# EAGLE design catbit (EAGLE 9.6.2)
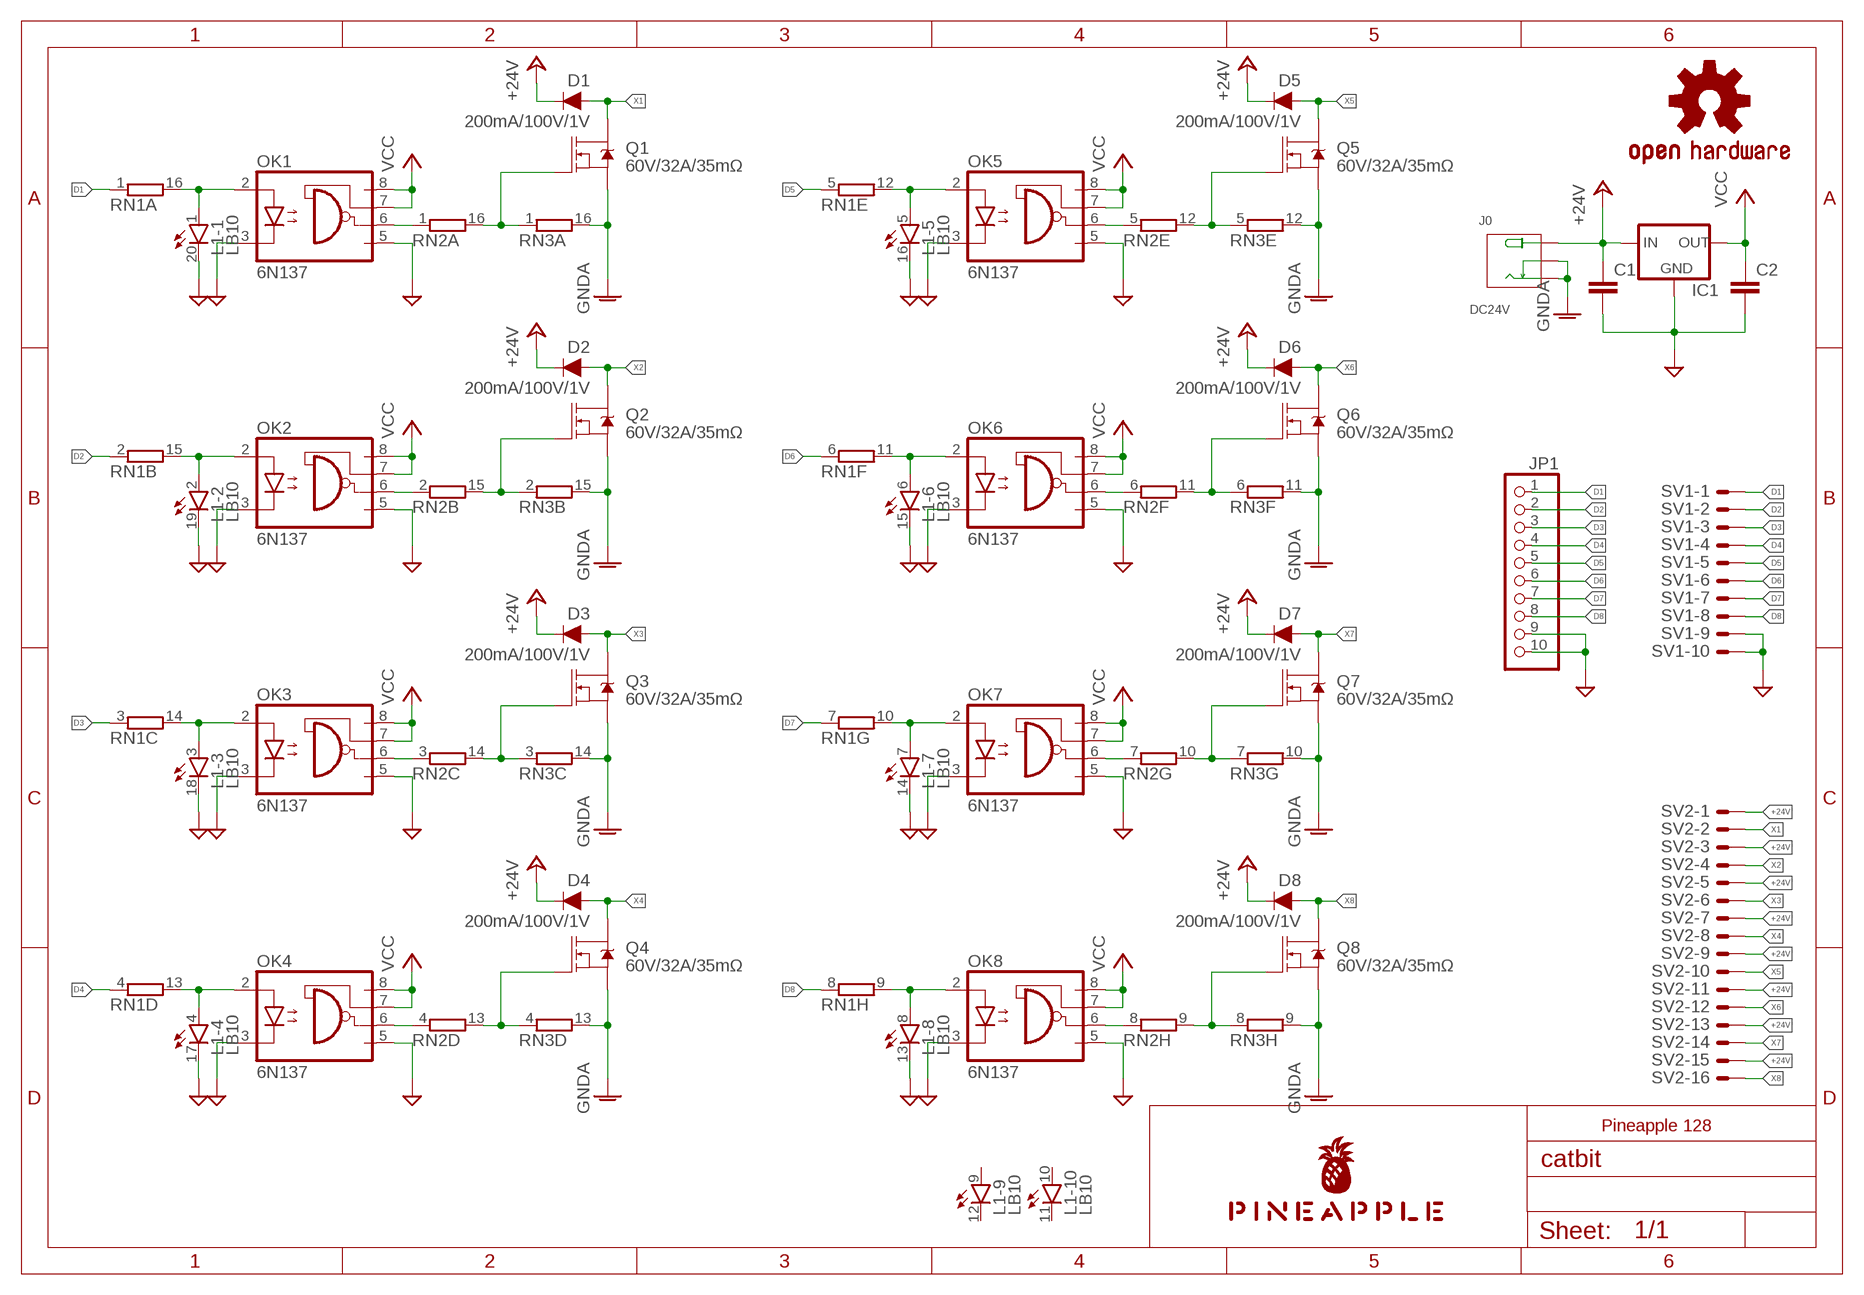
[diagram p0: schematic, sheet 1]

## Parts
C1  C-EU025-024X044  [C025-024X044]
C2  C-EU025-024X044  [C025-024X044]
D1  200mA/100V/1V  DIODE-1N4148  [DIODE-1N4148]
D2  200mA/100V/1V  DIODE-1N4148  [DIODE-1N4148]
D3  200mA/100V/1V  DIODE-1N4148  [DIODE-1N4148]
D4  200mA/100V/1V  DIODE-1N4148  [DIODE-1N4148]
D5  200mA/100V/1V  DIODE-1N4148  [DIODE-1N4148]
D6  200mA/100V/1V  DIODE-1N4148  [DIODE-1N4148]
D7  200mA/100V/1V  DIODE-1N4148  [DIODE-1N4148]
D8  200mA/100V/1V  DIODE-1N4148  [DIODE-1N4148]
IC1  78XXS  [78XXS]
J0  DC24V  JACK-DC-005'DC-005'  [3P-L14.2*W11.0*H9.0MM]
JP1  PINHD-1X10  [1X10]
L1  LB10  [LB10]
LOGO1  OSHW-LOGOS-COPPER  [OSHW-LOGO-S_COPPER]
OK1  6N137  [DIL08]
OK2  6N137  [DIL08]
OK3  6N137  [DIL08]
OK4  6N137  [DIL08]
OK5  6N137  [DIL08]
OK6  6N137  [DIL08]
OK7  6N137  [DIL08]
OK8  6N137  [DIL08]
Q1  60V/32A/35mΩ  MOSFET-NCH-FQP30N06L  [TO220V]
Q2  60V/32A/35mΩ  MOSFET-NCH-FQP30N06L  [TO220V]
Q3  60V/32A/35mΩ  MOSFET-NCH-FQP30N06L  [TO220V]
Q4  60V/32A/35mΩ  MOSFET-NCH-FQP30N06L  [TO220V]
Q5  60V/32A/35mΩ  MOSFET-NCH-FQP30N06L  [TO220V]
Q6  60V/32A/35mΩ  MOSFET-NCH-FQP30N06L  [TO220V]
Q7  60V/32A/35mΩ  MOSFET-NCH-FQP30N06L  [TO220V]
Q8  60V/32A/35mΩ  MOSFET-NCH-FQP30N06L  [TO220V]
RN1  8R-N  [DIL16]
RN2  8R-N  [DIL16]
RN3  8R-N  [DIL16]
SV1  ML10LE  [ML10L]
SV2  ML16LE  [ML16L]
U$1  PINEAPPLE450_SILK  [PINEAPPLE450_SILK]

## Nets
+24V [power]: C1.1 D1.C D2.C D3.C D4.C D5.C D6.C D7.C D8.C IC1.IN J0.+ SV2.1 SV2.3 SV2.5 SV2.7 SV2.9 SV2.11 SV2.13 SV2.15
D1: JP1.1 RN1.1 SV1.1
D2: JP1.2 RN1.2 SV1.2
D3: JP1.3 RN1.3 SV1.3
D4: JP1.4 RN1.4 SV1.4
D5: JP1.5 RN1.5 SV1.5
D6: JP1.6 RN1.6 SV1.6
D7: JP1.7 RN1.7 SV1.7
D8: JP1.8 RN1.8 SV1.8
GND [gnd]: C1.2 C2.2 IC1.GND JP1.9 JP1.10 L1.13(-8:C) L1.14(-7:C) L1.15(-6:C) L1.16(-5:C) L1.17(-4:C) L1.18(-3:C) L1.19(-2:C) L1.20(-1:C) OK1.3(C) OK1.5(GND) OK2.3(C) OK2.5(GND) OK3.3(C) OK3.5(GND) OK4.3(C) OK4.5(GND) OK5.3(C) OK5.5(GND) OK6.3(C) OK6.5(GND) OK7.3(C) OK7.5(GND) OK8.3(C) OK8.5(GND) SV1.9 SV1.10
GNDA [gnd]: J0.-1(-) J0.-2(CDN) Q1.3(S) Q2.3(S) Q3.3(S) Q4.3(S) Q5.3(S) Q6.3(S) Q7.3(S) Q8.3(S) RN3.9 RN3.10 RN3.11 RN3.12 RN3.13 RN3.14 RN3.15 RN3.16
N$1: L1.1(-1:A) OK1.2(A) RN1.16
N$2: OK1.6(VO) RN2.1
N$3: Q1.1(G) RN2.16 RN3.1
N$4: L1.2(-2:A) OK2.2(A) RN1.15
N$5: OK2.6(VO) RN2.2
N$6: Q2.1(G) RN2.15 RN3.2
N$7: L1.3(-3:A) OK3.2(A) RN1.14
N$8: OK3.6(VO) RN2.3
N$9: Q3.1(G) RN2.14 RN3.3
N$10: L1.4(-4:A) OK4.2(A) RN1.13
N$11: OK4.6(VO) RN2.4
N$12: Q4.1(G) RN2.13 RN3.4
N$13: L1.5(-5:A) OK5.2(A) RN1.12
N$14: OK5.6(VO) RN2.5
N$15: Q5.1(G) RN2.12 RN3.5
N$16: L1.6(-6:A) OK6.2(A) RN1.11
N$17: OK6.6(VO) RN2.6
N$18: Q6.1(G) RN2.11 RN3.6
N$19: L1.7(-7:A) OK7.2(A) RN1.10
N$20: OK7.6(VO) RN2.7
N$21: Q7.1(G) RN2.10 RN3.7
N$22: L1.8(-8:A) OK8.2(A) RN1.9
N$23: OK8.6(VO) RN2.8
N$24: Q8.1(G) RN2.9 RN3.8
VCC [power]: C2.1 IC1.OUT OK1.7(VE) OK1.8(VCC) OK2.7(VE) OK2.8(VCC) OK3.7(VE) OK3.8(VCC) OK4.7(VE) OK4.8(VCC) OK5.7(VE) OK5.8(VCC) OK6.7(VE) OK6.8(VCC) OK7.7(VE) OK7.8(VCC) OK8.7(VE) OK8.8(VCC)
X1: D1.A Q1.2(D) SV2.2
X2: D2.A Q2.2(D) SV2.4
X3: D3.A Q3.2(D) SV2.6
X4: D4.A Q4.2(D) SV2.8
X5: D5.A Q5.2(D) SV2.10
X6: D6.A Q6.2(D) SV2.12
X7: D7.A Q7.2(D) SV2.14
X8: D8.A Q8.2(D) SV2.16
Unconnected: L1.9(-9:A) L1.10(-10:A) L1.11(-10:C) L1.12(-9:C)

## Notes on the sheet
- Pineapple 128

## Library data of the parts
C1 C2 = resistor:C-EU: CAPACITOR, European symbol
D1-D8 = SparkFun-DiscreteSemi:DIODE: Diode These are standard reverse protection diodes and small signal diodes. SparkFun Products: SparkFun SparkPunk Sound Kit <https://www.sparkfun.com/products/11177> SparkFun ESP8266 Thing <https://www.sparkfun.com/products/13231>; PROD_ID: DIO-08378
IC1 = v-reg:78XXS: VOLTAGE REGULATOR
J0 = Seeed-Connector:JACK-DC-005: 320120003
JP1 = pinhead:PINHD-1X10: PIN HEADER
L1 = led:LB10: LED BLOCK 10-LED bar graph, DIL, Siemens
LOGO1 = SparkFun-Aesthetics:OSHW-LOGO: Open-Source Hardware (OSHW) Logo This logo indicates the piece of hardware it is found on incorporates a OSHW license and/or adheres to the definition of open source hardware found here: http://freedomdefined.org/OSHW
OK1-OK8 = optocoupler:6N137: MOTOROLA OPTO COUPLER; MPN: 6N137; OC_FARNELL: 1328376; OC_NEWARK: 52M1895
Q1-Q8 = SparkFun-DiscreteSemi:MOSFET-NCH: N-channel MOSFETs Voltage controlled devices that allow control of high current outputs. SparkFun Products: SparkFun OpenScale <https://www.sparkfun.com/products/13261> SparkFun Digital Sandbox <https://www.sparkfun.com/products/12651> SparkFun Monster Moto Shield <https://www.sparkfun.com/products/10182> SparkFun MOSFET Power Controller <https://www.sparkfun.com/products/11214>; PROD_ID: TRANS-10060
RN1-RN3 = resistor-dil:8R-N: DIL RESISTOR; OC_FARNELL: unknown; OC_NEWARK: unknown
SV1 = con-ml:ML10LE: HARTING; OC_FARNELL: unknown; OC_NEWARK: unknown
SV2 = con-ml:ML16LE: HARTING; OC_FARNELL: unknown; OC_NEWARK: unknown
U$1 = pineapple:PINEAPPLE450_SILK

## Net classes
0 default: width 0.152 mm, drill 0.152 mm, clearance 0.152 mm
1 gnd: width 0.305 mm, drill 0.152 mm, clearance 0.152 mm
2 power: width 0.305 mm, drill 0.152 mm, clearance 0.152 mm
3 analog: width 0.152 mm, drill 0.152 mm, clearance 0.152 mm

## Board
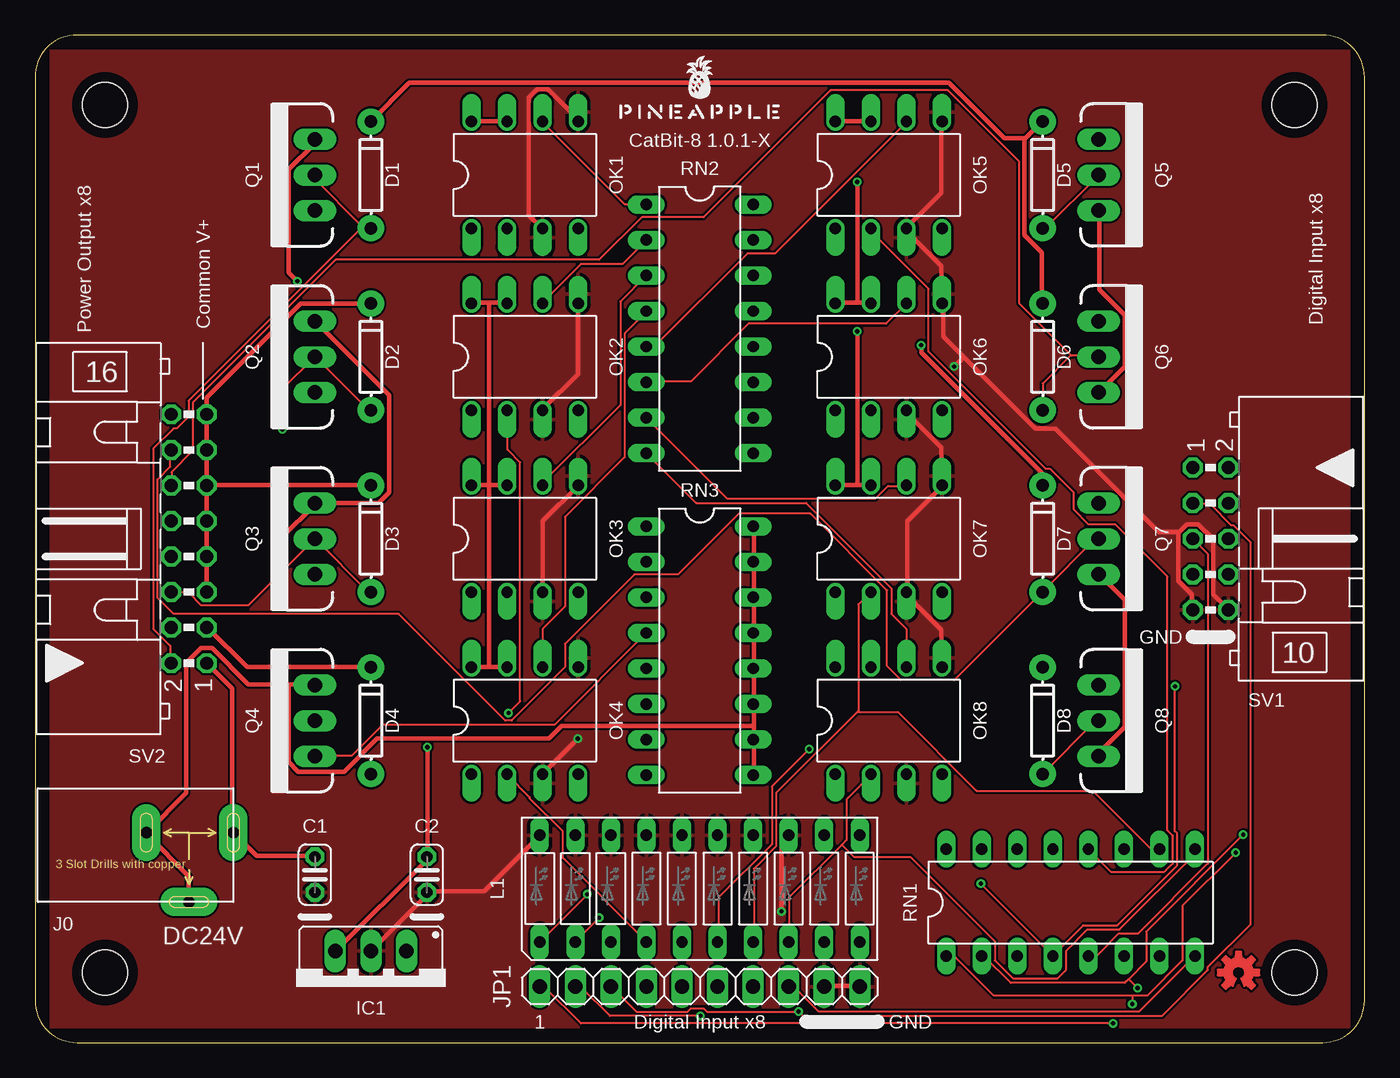
[diagram p1: board, top side]
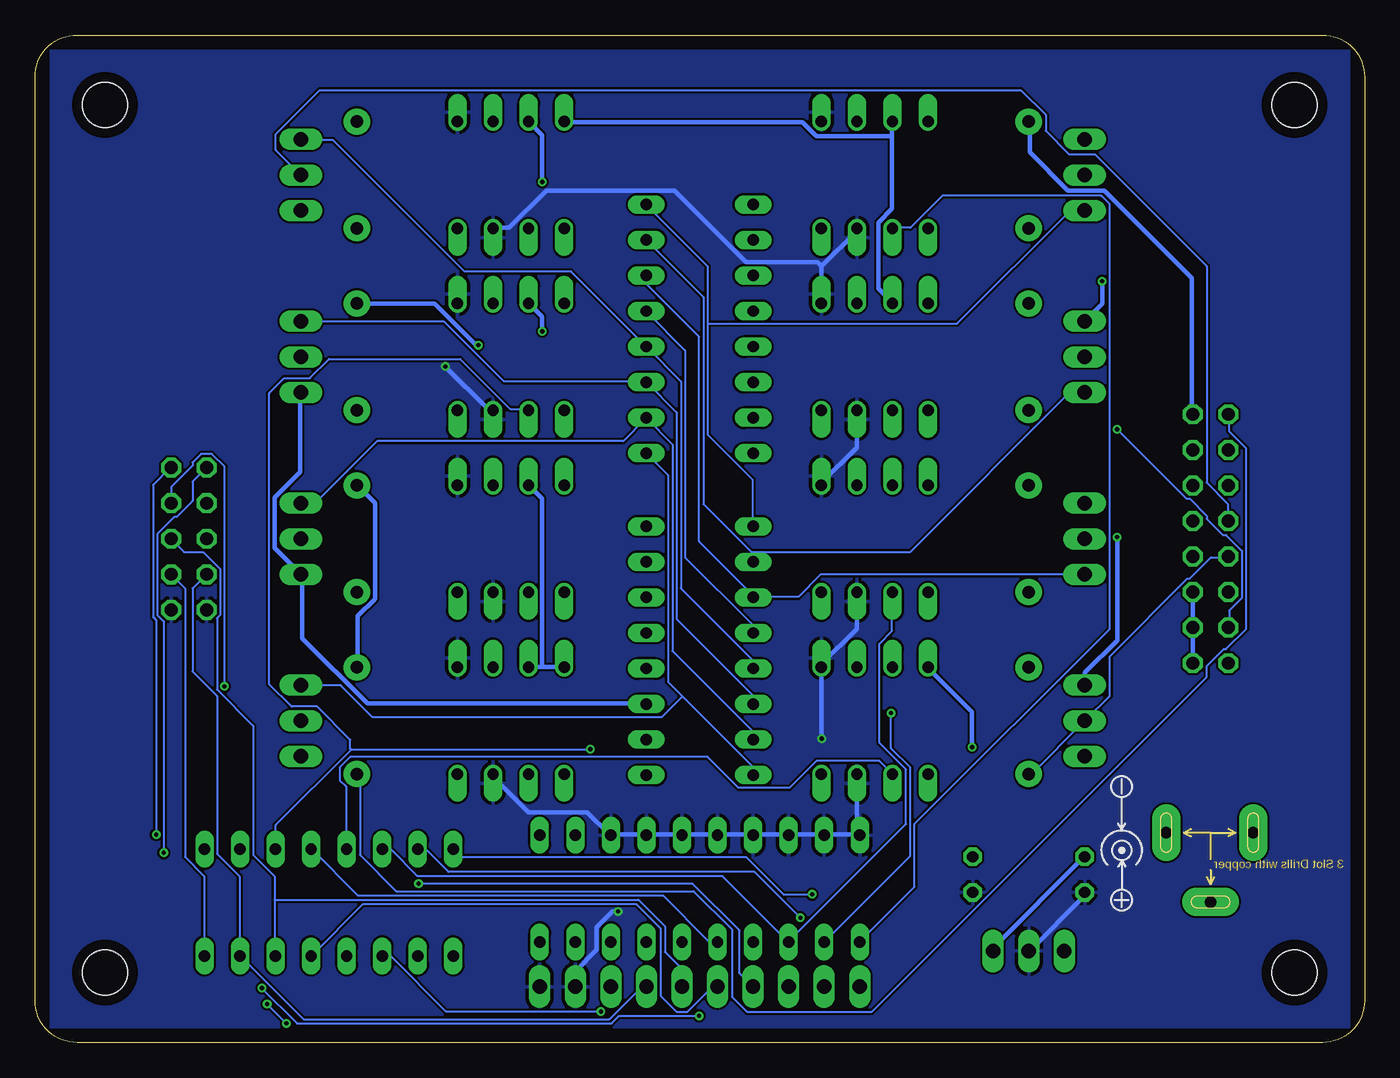
[diagram p2: board, bottom side, seen from below]

Size 95 x 72 mm. Coordinates in mm from the lower left corner, seen from the top.
Outline: 3,0 92,0 arc90 95,3 95,69 arc90 92,72 3,72 arc90 0,69 0,3 arc90 3,0
Copper layers (1*16): Top 0.035mm / dielectric 1.5mm / Bottom 0.035mm
Design rules "SeeedStudio_2layer_DRU_no_angle_20140221": minimum track width 6mil, minimum drill 12mil, track to track 6mil, track to pad 6mil, pad to pad 6mil, via to via 6mil, smd to smd 0mil, copper to edge 10mil, drill to drill 10mil, minimum pad ring 10mil, minimum via ring 6mil, stop-mask expansion 2mil, vias tented up to drill 100mil, thermal gap 10mil
Holes 3.2 mm at 5,5 90,5 90,67 5,67
tRestrict: area 2.8,64.8 to 7.2,69.2; area 87.8,64.8 to 92.2,69.2; area 2.8,2.8 to 7.2,7.2; area 87.8,2.8 to 92.2,7.2; area 0,71 to 95,72; area 94,0 to 95,72; area 0,0 to 95,1; area 0,0 to 1,72
bRestrict: area 2.8,2.8 to 7.2,7.2; area 87.8,2.8 to 92.2,7.2; area 87.8,64.8 to 92.2,69.2; area 2.8,64.8 to 7.2,69.2; area 0,71 to 95,72; area 94,0 to 95,72; area 0,0 to 95,1; area 0,0 to 1,72

### Footprints (pad centres in the part's own frame; a part is rotated, then mirrored left to right if it is on the bottom)
C025-024X044 = drill 0.813 octagon: 1 -1.27,0; 2 1.27,0
DIODE-1N4148 = drill 0.9 pad 1.88: A -3.81,0; C 3.81,0
78XXS = drill 1.016 long: GND 0,-2.54; IN -2.54,-2.54; OUT 2.54,-2.54
3P-L14.2*W11.0*H9.0MM = drill 0.813 pad 2.032 long: + 3.175,0; -1 -3.048,0; -2 0,-4.953
1X10 = drill 1.016 long: 1 -11.43,0; 2 -8.89,0; 3 -6.35,0; 4 -3.81,0; 5 -1.27,0; 6 1.27,0; 7 3.81,0; 8 6.35,0; 9 8.89,0; 10 11.43,0
LB10 = drill 0.813 long: 1 -11.43,-3.81; 2 -8.89,-3.81; 3 -6.35,-3.81; 4 -3.81,-3.81; 5 -1.27,-3.81; 6 1.27,-3.81; 7 3.81,-3.81; 8 6.35,-3.81; 9 8.89,-3.81; 10 11.43,-3.81; 11 11.43,3.81; 12 8.89,3.81; 13 6.35,3.81; 14 3.81,3.81; 15 1.27,3.81; 16 -1.27,3.81; 17 -3.81,3.81; 18 -6.35,3.81; 19 -8.89,3.81; 20 -11.43,3.81
DIL08 = drill 0.813 offset: 1 -3.81,-3.81; 2 -1.27,-3.81; 3 1.27,-3.81; 4 3.81,-3.81; 5 3.81,3.81; 6 1.27,3.81; 7 -1.27,3.81; 8 -3.81,3.81
TO220V = drill 1.016 long: 1 -2.54,0; 2 0,0; 3 2.54,0
DIL16 = drill 0.813 long: 1 -8.89,-3.81; 2 -6.35,-3.81; 3 -3.81,-3.81; 4 -1.27,-3.81; 5 1.27,-3.81; 6 3.81,-3.81; 7 6.35,-3.81; 8 8.89,-3.81; 9 8.89,3.81; 10 6.35,3.81; 11 3.81,3.81; 12 1.27,3.81; 13 -1.27,3.81; 14 -3.81,3.81; 15 -6.35,3.81; 16 -8.89,3.81
ML10L = drill 0.914 octagon: 1 -5.08,-1.27; 2 -5.08,1.27; 3 -2.54,-1.27; 4 -2.54,1.27; 5 0,-1.27; 6 0,1.27; 7 2.54,-1.27; 8 2.54,1.27; 9 5.08,-1.27; 10 5.08,1.27
ML16L = drill 0.914 octagon: 1 -8.89,-1.27; 2 -8.89,1.27; 3 -6.35,-1.27; 4 -6.35,1.27; 5 -3.81,-1.27; 6 -3.81,1.27; 7 -1.27,-1.27; 8 -1.27,1.27; 9 1.27,-1.27; 10 1.27,1.27; 11 3.81,-1.27; 12 3.81,1.27; 13 6.35,-1.27; 14 6.35,1.27; 15 8.89,-1.27; 16 8.89,1.27

### Placement (x,y rotation side)
C1  20,12 270 top
C2  28,12 270 top
D1  24,62 90 top
D2  24,49 90 top
D3  24,36 90 top
D4  24,23 90 top
D5  72,62 90 top
D6  72,49 90 top
D7  72,36 90 top
D8  72,23 90 top
IC1  24,4 180 top
J0  11,15 0 top
JP1  47.5,4 0 top
L1  47.5,11 0 top
LOGO1  86,5 0 top
OK1  35,62 0 top
OK2  35,49 0 top
OK3  35,36 0 top
OK4  35,23 0 top
OK5  61,62 0 top
OK6  61,49 0 top
OK7  61,36 0 top
OK8  61,23 0 top
Q1  20,62 90 top
Q2  20,49 90 top
Q3  20,36 90 top
Q4  20,23 90 top
Q5  76,62 270 top
Q6  76,49 270 top
Q7  76,36 270 top
Q8  76,23 270 top
RN1  74,10 0 top
RN2  47.5,51 270 top
RN3  47.5,28 270 top
SV1  84,36 270 top
SV2  11,36 90 top
U$1  47.5,66 0 top

### Tracks (layer width: path | path; a pad name or v marks a point on that pad's centre or on a via)
+24V  (via drill 0.3)
  Top 0.305: 70.71,64.54 70.71,57.68 71.93,56.46 71.93,52.88 D6.C | 70.71,64.54 71.93,65.76 D5.C | v63.32,49.84 63.32,49.3 71.93,40.69 71.93,39.85 D7.C | C1.1 19.96,13.34 15.85,13.34 14.25,14.94 J0.+ 14.1,15.09 14.1,25.3 12.34,27.05 SV2.1 | SV2.5 12.27,32.23 12.27,34.67 SV2.7 12.27,34.82 SV2.9 12.27,37.41 12.27,39.78 SV2.11 | SV2.11 12.27,39.93 12.27,42.29 SV2.13 12.27,42.44 SV2.15 12.27,45.03 12.27,46.1 18.97,52.81 23.93,52.81 D2.C | D4.C 23.93,26.82 15.16,26.82 12.34,29.64 SV2.3 | D3.C 23.93,39.85 12.42,39.85 SV2.11 | 70.71,64.54 70.64,64.62 69.27,64.62 65.3,68.58 26.75,68.58 24,65.84 D1.C
  Bottom 0.305: D8.C 71.93,26.82 71.93,30.48 70.71,31.7 70.71,38.56 71.93,39.78 D7.C | v63.32,49.84 63.48,49.84 66.45,52.81 71.93,52.81 D6.C | IC1.IN 26.52,6.55 26.52,6.78 20.04,13.26 C1.1 | SV2.1 12.27,27.13 SV2.3 12.27,29.79 12.27,32.16 SV2.5 | D1.C 23.93,65.76 23.93,63.63 21.18,60.88 18.59,60.88 12.34,54.63 12.34,44.96 SV2.15
D1  (via drill 0.3)
  Top 0.152: 78.41,3.35 79.48,3.35 81.99,5.87 81.99,9.75 v85.8,13.56 | 78.41,3.35 68.5,3.35 65.68,6.17 65.15,6.17 RN1.1 | v77.04,1.37 39.01,1.37 36.42,3.96 36.12,3.96 JP1.1 | 78.41,3.35 v78.41,2.74
  Bottom 0.152: v85.8,13.56 85.8,30.1 86.26,30.56 86.26,36.35 85.04,37.57 84.89,37.57 83.74,38.71 83.74,40.08 82.75,41.07 SV1.1 | v78.41,2.74 v77.04,1.37
D2  (via drill 0.3)
  Top 0.152: 78.14,4.53 79.4,5.79 79.4,7.92 v86.33,14.86 | 78.14,4.53 77.88,4.27 69.72,4.27 67.82,6.17 67.67,6.17 RN1.2 | v47.55,1.91 41.07,1.91 39.01,3.96 38.63,3.96 JP1.2 | 78.14,4.53 v78.79,3.89
  Bottom 0.152: v86.33,14.86 86.33,30.18 86.56,30.4 86.56,39.85 85.34,41.07 SV1.2 | v47.55,1.91 53.26,1.91 53.8,1.37 76.28,1.37 v78.79,3.89
D3  (via drill 0.3)
  Top 0.152: JP1.3 41.22,3.96 42.98,2.21 46.63,2.21 46.86,2.44 47.78,2.44 48.01,2.21 v54.56,2.21 54.86,1.91 80.54,1.91 83.82,5.18 83.82,5.41 86.87,8.46 86.87,35.74 85.65,36.96 85.5,36.96 83.97,38.48 82.75,38.48 SV1.3
  Bottom 0.152: v54.56,2.21 65.61,2.21 69.57,6.17 70.18,6.17 RN1.3
D4  (via drill 0.3)
  Top 0.152: v67.59,11.35 72.69,6.25 RN1.4 72.77,6.25 74.91,8.38 77.34,8.38 81.61,12.65 81.61,14.94 81.46,15.09 v81.46,25.45
  Bottom 0.152: v67.59,11.35 48.01,11.35 44.65,8 44.65,4.95 43.74,4.04 JP1.4 | v81.46,25.45 81.46,41.15 82.37,42.06 83.13,42.06 83.74,41.45 83.74,41.22 85.27,39.7 85.27,38.56 SV1.4
D5
  Top 0.152: RN1.5 75.29,6.25 75.89,6.25 77.42,7.77 78.79,7.77 83.82,12.8 83.82,34.9 82.75,35.97 SV1.5
  Bottom 0.152: JP1.5 46.25,3.96 46.63,3.96 48.39,2.21 49.15,2.21 50.29,3.35 50.29,8.15 52.05,9.91 71.55,9.91 75.21,6.25 RN1.5
D6
  Bottom 0.152: 77.88,10.21 77.88,11.89 79.4,13.41 79.4,22.63 81.99,25.22 81.99,30.33 81.76,30.56 81.76,33.83 82.98,35.05 84.35,35.05 85.27,35.97 SV1.6 | 77.88,10.21 77.88,6.25 RN1.6 | 77.88,10.21 51.89,10.21 49.99,8.31 49.99,6.48 48.84,5.33 48.84,4.04 JP1.6
D7
  Bottom 0.152: SV1.7 82.75,33.45 83.74,32.46 83.74,26.52 81.99,24.77 81.99,13.49 80.39,11.89 80.39,6.25 RN1.7 80.31,6.17 75.82,1.68 53.95,1.68 51.66,3.96 51.36,3.96 JP1.7
D8
  Top 0.152: JP1.8 53.87,3.96 54.25,3.96 56.01,2.21 78.87,2.21 82.83,6.17 RN1.8
  Bottom 0.152: RN1.8 82.91,6.25 82.91,11.89 84.28,13.26 84.28,32.46 SV1.8
GND  (via drill 0.3)
  Top 0.305: OK8.5 64.77,26.82 64.77,29.49 62.33,31.93 62.33,32.16 OK7.3 62.33,32.31 62.33,37.26 64.77,39.7 OK7.5 64.77,39.85 64.77,42.52 62.33,44.96 62.33,45.19 OK6.3 | 81.69,36.42 81.69,32.99 82.68,32 82.68,30.94 SV1.9 | 81.69,36.42 82.3,37.03 83.13,37.03 84.2,35.97 84.2,32 85.27,30.94 SV1.10 | OK5.5 64.77,65.76 64.77,60.73 62.33,58.29 OK5.3 62.33,58.14 62.33,57.91 64.77,55.47 64.77,52.88 OK6.5 64.92,52.73 64.92,50.44 66.37,49 | 66.37,49 71.48,43.89 72.92,43.89 80.31,36.5 81.61,36.5 81.69,36.42 | 66.37,49 v65.68,48.31 | OK1.5 38.79,65.84 38.79,65.99 36.65,68.12 35.89,68.12 35.28,67.51 35.28,59.13 36.2,58.22 OK1.3 | OK3.3 36.27,32.23 36.27,37.26 38.79,39.78 OK3.5 | OK2.5 38.79,52.81 38.79,47.78 36.27,45.26 OK2.3 | IC1.GND 24,6.55 27.96,10.52 27.96,10.67 C2.2 28.12,10.82 32.08,10.82 36.04,14.78 L1.20 | JP1.9 56.46,4.04 58.9,4.04 JP1.10 | v53.34,9.37 53.34,14.33 53.8,14.78 L1.13 | v38.79,21.72 36.27,19.2 OK4.3
  Bottom 0.305: v65.68,48.31 62.64,45.26 62.33,45.26 OK6.3 | 38.79,55.47 38.79,52.88 OK2.5 | 38.79,55.47 36.27,57.99 36.27,58.14 OK1.3 | OK3.3 36.27,32.16 36.27,29.57 38.79,27.05 38.79,26.82 OK4.5 38.79,26.67 v38.79,21.72 | OK2.3 36.27,42.52 38.79,40.01 38.79,39.85 OK3.5 | C1.2 20.04,10.67 20.04,10.44 23.93,6.55 IC1.GND | OK4.3 36.27,19.13 36.27,14.94 L1.20 36.12,14.86 38.56,14.86 L1.19 38.71,14.86 41.15,14.86 L1.18 41.3,14.86 43.66,14.86 L1.17 43.81,14.86 46.18,14.86 L1.16 46.33,14.86 48.77,14.86 L1.15 48.92,14.86 51.28,14.86 L1.14 51.44,14.86 53.8,14.86 L1.13 53.95,14.86 55.55,16.46 59.74,16.46 62.26,18.97 62.26,19.13 OK8.3 | v53.34,9.37 53.72,9.37 54.86,8.23 54.86,6.63 56.39,5.11 56.39,4.04 JP1.9 | 38.79,55.47 39.09,55.78 44.2,55.78 49.3,60.88 58.45,60.88 61.11,58.22 62.26,58.22 OK5.3
  pour Top: -1,-1 96,-1 96,73 -1,73
  pour Bottom: -2,-2 97,-2 97,74 -2,74
GNDA  (via drill 0.3)
  Top 0.305: RN3.9 51.36,19.13 51.36,21.64 RN3.10 51.36,21.79 51.36,22.63 | 51.36,22.63 51.36,24.16 RN3.11 51.36,24.31 51.36,26.67 RN3.12 51.36,26.82 51.36,29.26 RN3.13 51.36,29.41 51.36,31.77 RN3.14 51.36,31.93 51.36,34.29 RN3.15 51.36,34.44 51.36,36.88 RN3.16 | Q8.3 76.05,20.5 76.05,20.73 77.88,22.55 77.88,31.62 76.05,33.45 Q7.3 | Q5.3 76.05,59.44 76.05,53.8 77.88,51.97 77.88,48.31 76.05,46.48 Q6.3 | Q2.3 20.04,51.51 25.3,46.25 25.3,39.32 24.54,38.56 20.04,38.56 Q3.3 19.96,38.41 v17.68,36.12 | v18.75,54.41 18.14,55.02 18.14,62.41 19.96,64.24 19.96,64.47 Q1.3 | 18.14,25.6 15.24,25.6 12.65,28.19 11.89,28.19 10.82,27.13 10.82,17.83 8,15.01 J0.-1 8,14.86 10.97,11.89 10.97,10.06 J0.-2 | 18.14,25.6 19.96,25.6 Q4.3 | 51.36,22.63 37.64,22.63 36.73,21.72 24.46,21.72 22.1,19.36 18.82,19.36 18.14,20.04 18.14,25.6
  Bottom 0.305: Q6.3 76.05,46.41 76.05,40.77 77.88,38.94 77.88,35.36 76.05,33.53 Q7.3 75.89,33.38 75.89,28.88 71.25,24.23 51.36,24.23 RN3.11 | v18.75,54.41 18.75,52.81 19.96,51.59 Q2.3 | v17.68,36.12 17.68,28.73 19.96,26.44 19.96,25.6 Q4.3
N$1  (via drill 0.3)
  Top 0.152: v39.47,10.59 36.12,7.24 L1.1
  Bottom 0.152: v39.47,10.59 41.53,10.59 44.2,13.26 64.54,13.26 65.08,13.79 RN1.16 | OK1.2 33.68,58.22 32.46,58.22 30.18,60.5 18.82,60.5 18.21,59.89 18.21,29.57 32.16,15.62 32.16,11.12 36.04,7.24 L1.1
N$2
  Top 0.152: RN2.1 43.66,59.89 42.14,59.89 36.27,65.76 OK1.6
N$3
  Bottom 0.152: 46.94,51.36 46.94,55.47 51.28,59.82 RN2.16 | 46.94,51.36 46.94,43.43 43.74,40.23 43.74,36.96 RN3.1 | 46.94,51.36 29.11,51.36 21.03,59.44 20.04,59.44 Q1.1
N$4  (via drill 0.3)
  Top 0.152: v33.83,23.55 34.67,24.38 34.67,41.45 33.76,42.37 33.76,45.19 OK2.2 | v40.31,8.91 38.63,7.24 L1.2
  Bottom 0.152: v33.83,23.55 33.83,21.03 32.46,19.66 32.46,13.34 38.56,7.24 L1.2 | v40.31,8.91 43.59,12.19 65.46,12.19 67.06,13.79 67.59,13.79 RN1.15
N$5
  Top 0.152: OK2.6 36.27,52.88 39.01,55.63 41.99,55.63 43.66,57.3 RN2.2
N$6
  Bottom 0.152: 43.78,35.01 47.24,38.48 47.24,53.26 51.28,57.3 RN2.15 | 43.78,35.01 43.74,34.98 43.74,34.37 RN3.2 | Q2.1 20.04,46.41 21.11,46.41 32.46,35.05 43.74,35.05 43.78,35.01
N$7
  Bottom 0.152: OK3.2 33.76,32.16 33.76,29.41 34.67,28.5 34.67,21.41 32.77,19.51 32.77,15.62 41.15,7.24 L1.3 41.22,7.24 45.87,11.89 67.67,11.89 69.57,13.79 70.18,13.79 RN1.14
N$8
  Top 0.152: OK3.6 36.27,39.85 36.27,40.01 41.83,45.57 41.83,52.96 43.66,54.79 RN2.3
N$9
  Bottom 0.152: Q3.1 20.04,33.45 38.86,33.45 40.46,31.85 43.66,31.85 RN3.3 43.66,31.93 47.55,35.81 47.55,50.44 51.28,54.18 51.28,54.79 RN2.14
N$10
  Top 0.152: OK4.2 33.76,19.13 35.36,17.53 35.36,17.45 37.72,15.09 37.72,13.18 43.66,7.24 L1.4
  Bottom 0.152: RN1.13 72.77,13.87 72.77,18.29 73.23,18.75 73.23,19.66 72.47,20.42 46.94,20.42 44.73,18.21 41.07,18.21 39.17,20.12 34.67,20.12 33.76,19.2 OK4.2
N$11
  Top 0.152: OK4.6 36.27,26.82 36.27,29.57 37.87,31.17 37.87,37.57 42.14,41.83 42.14,50.67 43.66,52.2 RN2.4
N$12
  Top 0.152: Q4.1 20.04,20.5 22.63,20.5 24.84,22.71 37.11,22.71 43.66,29.26 RN3.4
  Bottom 0.152: RN3.4 43.74,29.34 43.74,29.87 48.54,34.67 48.54,49.45 51.28,52.2 RN2.13
N$13
  Top 0.152: OK5.2 59.74,58.14 59.74,57.99 63.86,53.87 63.86,49.38 72.24,41 72.54,41 74.22,39.32 74.22,38.1 75.29,37.03 77.19,37.03 80.92,33.3 80.92,15.16 81.31,14.78 81.31,12.8 80.7,12.19 76.89,12.19 75.29,13.79 RN1.12
  Bottom 0.152: L1.5 46.25,7.24 46.86,7.24 50.14,10.52 71.93,10.52 75.21,13.79 RN1.12
N$14
  Top 0.152: RN2.5 43.74,49.76 44.27,49.76 50.9,56.39 52.88,56.39 62.26,65.76 OK5.6
N$15
  Bottom 0.152: RN3.5 43.74,26.75 43.74,27.36 48.84,32.46 48.84,47.24 51.28,49.68 RN2.12 51.36,49.76 56.69,55.09 64.31,55.09 73.69,64.47 75.97,64.47 Q5.1
N$16  (via drill 0.3)
  Top 0.152: v55.32,20.95 52.65,18.29 52.65,14.17 48.84,10.36 48.84,7.24 L1.6
  Bottom 0.152: v55.32,20.95 72.39,20.95 72.43,20.92 | 72.43,20.92 77.8,15.54 77.8,13.87 RN1.11 | OK6.2 59.74,45.26 61.04,45.26 64.62,48.84 73.99,48.84 75.36,47.47 77.19,47.47 78.26,46.41 78.26,25.6 76.66,24 74.83,24 72.47,21.64 72.47,20.95 72.43,20.92
N$17
  Top 0.152: RN2.6 43.74,47.24 46.86,47.24 50.98,51.36 60.81,51.36 62.26,52.81 OK6.6
N$18
  Bottom 0.152: RN3.6 43.74,24.23 43.74,24.84 49.15,30.25 49.15,45.03 51.28,47.17 RN2.11 51.36,47.24 61.49,47.24 65.76,51.51 75.97,51.51 Q6.1
N$19
  Top 0.152: 58.79,23.66 58.83,23.7 58.83,31.32 59.66,32.16 OK7.2 | 58.79,23.66 52.96,17.83 52.96,14.02 51.36,12.42 51.36,7.24 L1.7 | RN1.10 80.31,13.87 79.7,13.87 75.59,17.98 67.28,17.98 61.65,23.62 58.83,23.62 58.79,23.66
N$20
  Top 0.152: OK7.6 62.26,39.78 60.96,39.78 60.05,38.86 49.45,38.86 43.74,44.58 RN2.7
N$21
  Bottom 0.152: RN3.7 43.74,21.72 43.74,22.25 49.45,27.96 49.45,42.75 51.28,44.58 RN2.10 51.36,44.58 52.96,42.98 70.56,42.98 74.98,38.56 75.97,38.56 Q7.1
N$22
  Top 0.152: 57.65,14.13 57.99,14.48 57.99,17.37 59.74,19.13 OK8.2 | 57.65,14.13 53.87,10.36 53.87,7.24 L1.8 | 57.65,14.13 58.52,13.26 62.56,13.26 68.58,7.24 68.58,5.87 69.88,4.57 73.08,4.57 73.69,5.18 73.69,6.55 75.21,8.08 77.5,8.08 82.83,13.41 82.83,13.79 RN1.9
N$23
  Top 0.152: OK8.6 62.26,26.82 62.26,29.57 61.19,30.63 61.19,32.46 55.09,38.56 47.24,38.56 43.74,42.06 RN2.8
N$24
  Bottom 0.152: 48.73,24.73 49.76,25.76 49.76,40.54 51.28,42.06 RN2.9 | 48.73,24.73 43.74,19.74 43.74,19.13 RN3.8 | 48.73,24.73 50.22,23.24 70.87,23.24 73.15,25.53 75.97,25.53 Q8.1
VCC  (via drill 0.3)
  Top 0.305: 58.75,39.85 59.66,39.85 OK7.7 | 58.75,39.85 57.23,39.85 OK7.8 | 58.75,52.88 59.66,52.88 OK6.7 | 58.75,52.88 57.23,52.88 OK6.8 | OK5.8 57.23,65.84 59.66,65.84 OK5.7 | v58.75,61.49 58.75,52.88 | v58.75,50.83 58.75,39.85 | IC1.OUT 21.49,6.55 27.96,13.03 27.96,13.26 C2.1 28.04,13.41 v28.04,21.11 | OK1.8 31.24,65.84 33.68,65.84 OK1.7 | 32.46,52.88 33.68,52.88 OK2.7 | 32.46,52.88 31.24,52.88 OK2.8 | 32.46,26.82 33.68,26.82 OK4.7 | 32.46,26.82 31.24,26.82 OK4.8 | 32.46,39.85 33.68,39.85 OK3.7 | 32.46,39.85 31.24,39.85 OK3.8 | 32.46,39.85 32.46,26.82 | 32.46,39.85 32.46,52.88
  Bottom 0.305: 58.75,26.82 59.66,26.82 OK8.7 | 58.75,26.82 57.23,26.82 OK8.8 | 58.75,26.82 58.75,38.86 59.66,39.78 OK7.7 | v58.75,61.49 58.75,64.85 59.66,65.76 OK5.7 | v58.75,50.83 58.75,51.89 59.66,52.81 OK6.7 | 33.76,64.77 33.76,59.59 34.75,58.6 34.75,53.87 33.76,52.88 OK2.7 | 33.76,64.77 33.76,65.76 OK1.7 | v28.04,21.11 28.04,23.62 31.17,26.75 OK4.8 | 33.76,64.77 39.17,64.77 40.16,65.76 57.15,65.76 OK5.8
X1
  Top 0.152: SV2.2 9.68,27.13 9.68,28.35 8.46,29.57 8.46,42.44 9.91,43.89 10.13,43.89 10.97,44.73 10.97,45.87 23.24,58.14 23.93,58.14 D1.A 23.16,58.14 23.16,58.52 20.04,61.65 20.04,61.95 Q1.2
X2  (via drill 0.3)
  Top 0.152: v17.68,43.81 17.68,46.71 19.96,49 Q2.2 20.04,49 23.77,45.26 23.93,45.26 D2.A
  Bottom 0.152: v17.68,43.81 12.72,38.86 12.5,38.86 11.28,37.64 11.28,37.41 10.13,36.27 9.91,36.27 8.76,35.13 8.76,31.77 9.68,30.86 9.68,29.72 SV2.4
X3
  Top 0.152: SV2.6 9.75,32.16 10.97,32.16 11.89,31.24 15.24,31.24 19.96,35.97 Q3.2 20.04,35.97 23.77,32.23 23.93,32.23 D3.A
X4
  Bottom 0.152: SV2.8 9.75,34.67 10.97,34.67 12.5,33.15 12.65,33.15 18.21,27.58 18.21,24.77 19.96,23.01 Q4.2 20.04,22.94 23.77,19.2 23.93,19.2 D4.A
X5
  Top 0.152: D5.A 72.01,58.22 72.24,58.22 75.97,61.95 Q5.2
  Bottom 0.152: SV2.10 9.75,37.34 9.75,38.48 11.28,40.01 11.28,55.47 19.28,63.48 21.11,63.48 22.78,65.15 22.78,66.29 24.54,68.05 74.68,68.05 77.8,64.92 77.8,63.78 76.05,62.03 Q5.2
X6
  Top 0.152: 74.03,49.11 74.07,49.07 75.97,49.07 Q6.2 | 74.03,49.11 70.33,52.81 70.33,62.94 65.23,68.05 56.84,68.05 47.78,58.98 43.36,58.98 40.31,55.93 21.49,55.93 11.28,45.72 11.28,42.29 9.75,40.77 9.75,39.85 SV2.12 | 74.03,49.11 72.01,47.09 72.01,45.26 D6.A
X7
  Top 0.152: SV2.14 9.68,42.29 9.68,41.15 8.76,40.23 8.76,31.77 9.91,30.63 25.98,30.63 33.6,23.01 34.06,23.01 37.87,26.82 37.87,28.5 42.82,33.45 45.95,33.45 50.29,37.8 55.4,37.8 60.88,32.31 60.88,26.9 61.87,25.91 65.68,25.91 71.93,32.16 D7.A 72.01,32.23 75.74,35.97 75.97,35.97 Q7.2
X8
  Top 0.152: Q8.2 75.97,22.94 75.74,22.94 72.01,19.2 D8.A
  Bottom 0.152: SV2.16 9.68,44.88 9.68,43.66 8.46,42.44 8.46,29.57 9.91,28.12 10.06,28.12 11.28,26.9 11.28,26.14 35.2,2.21 44.12,2.21 45.19,3.28 45.19,8.08 47.93,10.82 69.19,10.82 71.78,13.41 71.78,18.97 71.93,19.13 D8.A

### Text on the board
tNames: CatBit-8 1.0.1-X | Power Output x8 | Digital Input x8 | Common V+ | GND | DC24V | GND | 1 | Digital Input x8